# EAGLE design ADS1115-Breakout-5V (EAGLE 8.1.1)
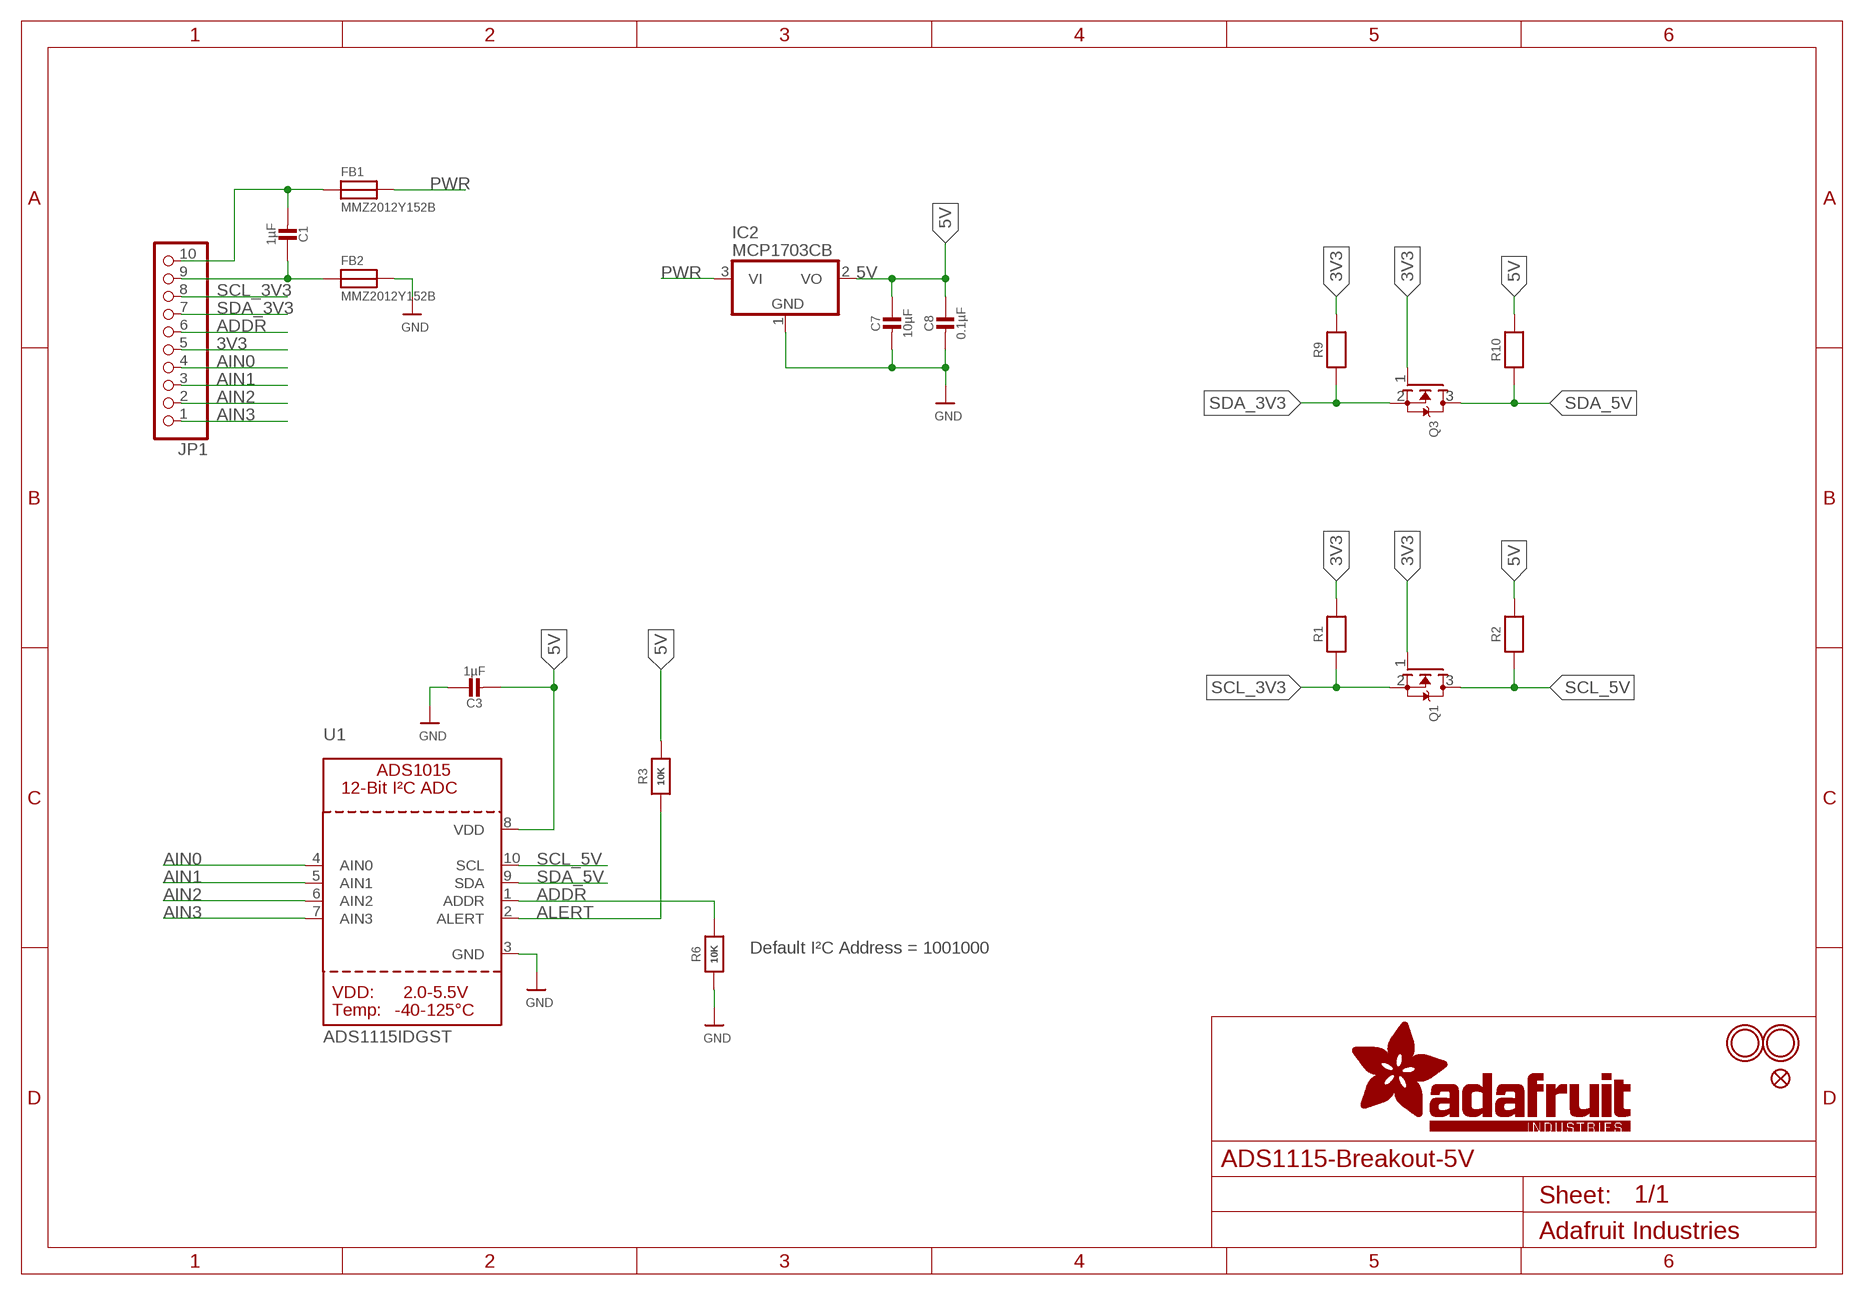
[diagram p0: schematic, sheet 1]

## Parts
C1  1µF  CAP_CERAMIC_0402MP  [_0402MP]
C3  1µF  CAP_CERAMIC_0402MP  [_0402MP]
C7  10µF  CAP_CERAMIC_0402MP  [_0402MP]
C8  0.1µF  CAP_CERAMIC_0402MP  [_0402MP]
FB1  MMZ2012Y152B  FERRITE0805  [0805]
FB2  MMZ2012Y152B  FERRITE0805  [0805]
FID1  FIDUCIAL""  [FIDUCIAL_1MM]
IC2  MCP1703CB  [SOT23]
JP1  HEADER-1X1070MIL  [1X10_ROUND70]
Q1  MOSFET-NREFLOW  [SOT23]
Q3  MOSFET-NREFLOW  [SOT23]
R1  RESISTOR_0402MP  [_0402MP]
R2  RESISTOR_0402MP  [_0402MP]
R3  10K  RESISTOR_0402MP  [_0402MP]
R6  10K  RESISTOR_0402MP  [_0402MP]
R9  RESISTOR_0402MP  [_0402MP]
R10  RESISTOR_0402MP  [_0402MP]
U1  ADS1115IDGST  ADC_ADS1015  [MSOP10]
U$13  MOUNTINGHOLE2.5  [MOUNTINGHOLE_2.5_PLATED]
U$14  MOUNTINGHOLE2.5  [MOUNTINGHOLE_2.5_PLATED]

## Nets
3V3: JP1.5 Q1.1(G) Q3.1(G) R1.2 R9.2
5V: C3.2 C7.1 C8.1 IC2.2(VO) R2.2 R3.2 R10.2 U1.8(VDD)
ADDR: JP1.6 R6.2 U1.1(ADDR)
AIN0: JP1.4 U1.4(AIN0)
AIN1: JP1.3 U1.5(AIN1)
AIN2: JP1.2 U1.6(AIN2)
AIN3: JP1.1 U1.7(AIN3)
ALERT: R3.1 U1.2(ALERT)
GND: C3.1 C7.2 C8.2 FB2.2 IC2.1(GND) R6.1 U1.3(GND)
N$1: C1.2 FB1.1 JP1.10
N$2: C1.1 FB2.1 JP1.9
PWR: FB1.2 IC2.3(VI)
SCL_3V3: JP1.8 Q1.2(S) R1.1
SCL_5V: Q1.3(D) R2.1 U1.10(SCL)
SDA_3V3: JP1.7 Q3.2(S) R9.1
SDA_5V: Q3.3(D) R10.1 U1.9(SDA)

## Notes on the sheet
- Default I²C Address = 1001000

## Library data of the parts
C1 C3 C7 C8 = TSL2591:CAP_CERAMIC: Ceramic Capacitors For new designs, use the packages preceded by an '_' character since they are more reliable: The following footprints should be used on most boards: _0402 - Standard footprint for regular board layouts _0603 - Standard footprint for regular board layouts _0805 - Standard footprint for regular board layouts _1206 - Standard footprint for regular board layouts For extremely tight-pitch boards where space is at a premium, the following 'micro-pitch' footprints can be used (smaller pads, no silkscreen outline, etc.): _0402MP - Micro-pitch footprint for very dense/compact boards _0603MP - Micro-pitch footprint for very dense/compact boards _0805MP - Micro-pitch footprint for very dense/compact boards _1206MP - Micro-pitch footprint for very dense/compact boards
FB1 FB2 = microbuilder:FERRITE: Ferrite Bead 0603 MMZ1608B121C - 120 Ohm, 600mA Ferrite Chip - Digikey: 445-2164-1-ND BK1608HW121-T - 120 Ohm, 600mA Ferrite Chip - Digikey: 587-1876-2-ND 0805 HZ0805B272R-10 - 2.7K Ohm @ 100MHz, 200mA 0.8 Ohm DC Resistance - Digikey: 240-2504-1-ND (see also Murata BLM21BD272SN1L)
FID1 = microbuilder:FIDUCIAL: Fiducial Alignment Points Various fiducial points for machine vision alignment.
IC2 = linear:MCP1703: 250 mA, 16V, Low Quiescent Current LDO Regulator Source: http://ww1.microchip.com/downloads/en/DeviceDoc/22049b.pdf
JP1 = microbuilder:HEADER-1X10: PIN HEADER
Q1 Q3 = adafruit:MOSFET-N: N-Channel Mosfet 2N7002E - 60V 260mA SOT23 [Digikey: 2N7002ET1GOSTR-ND] - REEL BSH103 - 30V 850mA SOT23 [Digikey: 568-5013-1-ND]
R1-R3 R6 R9 R10 = TSL2591:RESISTOR: Resistors For new designs, use the packages preceded by an '_' character since they are more reliable: The following footprints should be used on most boards: _0402 - Standard footprint for regular board layouts _0603 - Standard footprint for regular board layouts _0805 - Standard footprint for regular board layouts _1206 - Standard footprint for regular board layouts For extremely tight-pitch boards where space is at a premium, the following 'micro-pitch' footprints can be used (smaller pads, no silkscreen outline, etc.): _0402MP - Micro-pitch footprint for very dense/compact boards _0603MP - Micro-pitch footprint for very dense/compact boards _0805MP - Micro-pitch footprint for very dense/compact boards _1206MP - Micro-pitch footprint for very dense/compact boards
U1 = microbuilder:ADC_ADS1015: ADS1015 - 12-bit 4-Channel I2C ADC with Internal PGA VDD: 2.0-5.5V Sampling Rate: 3.3ksps Gain Settings: 2/3, 1, 2, 4, 8, 16 I2C Address: ADDR low = 1001000x, ADDR high = 1001001x Internal Comparator The ADS1015 includes an internal comparator that can be set to output a high-level on ALERT when the conversion results exceeeds a pre-defined upper level, and will deassert itself when the level falls below a pre-defined lower threshold level. It can also be set to windowed mode where the ALERT pin will be asserted if the data exceeds the upper threshold or falls below the lower threshold.
U$13 U$14 = microbuilder:MOUNTINGHOLE: Mounting Hole For #2 screws (0.086"/2.18mm width, 0.094"/2.4mm hole) use 2.5mm

## Board
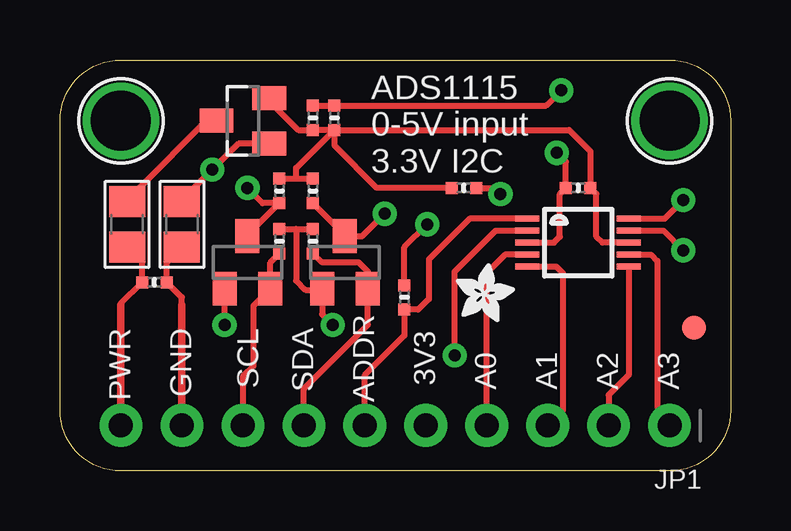
[diagram p1: board, top side]
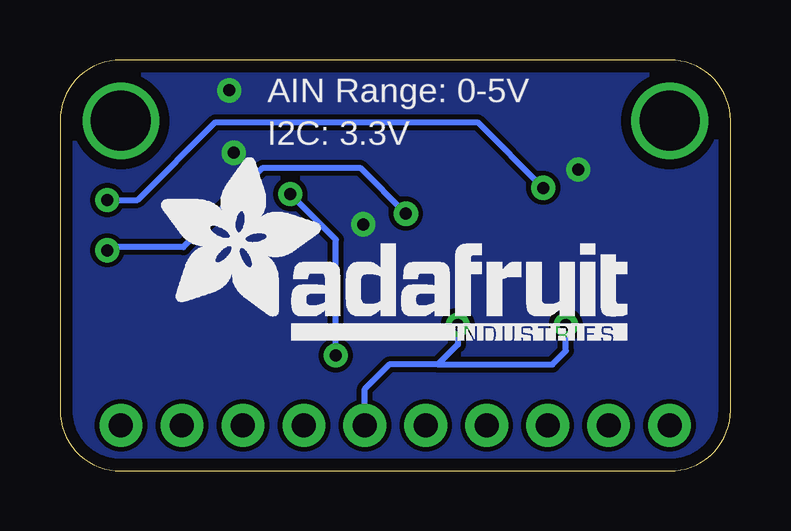
[diagram p2: board, bottom side, seen from below]

Size 27.94 x 17.14 mm. Coordinates in mm from the lower left corner, seen from the top.
Outline: 27.94,14.61 27.94,2.54 arc-90 25.4,0 2.54,0 arc-90 0,2.54 0,14.61 arc-90 2.54,17.14 25.4,17.14 arc-90 27.94,14.61
Copper layers (1*16): Top 0.035mm / dielectric 1.5mm / Bottom 0.035mm
Design rules "default": minimum track width 8mil, minimum drill 0.4mm, track to track 8mil, track to pad 8mil, pad to pad 8mil, via to via 8mil, smd to smd 8mil, copper to edge 20mil, drill to drill 8mil, minimum pad ring 8mil, minimum via ring 10mil, stop-mask expansion 3mil, vias tented up to drill 20mil, thermal gap 8mil

### Footprints (pad centres in the part's own frame; a part is rotated, then mirrored left to right if it is on the bottom)
_0402MP = smd 0.5 x 0.5: 1 -0.508,0; 2 0.508,0
0805 = smd 1.3 x 1.5: 1 -0.95,0; 2 0.95,0
FIDUCIAL_1MM = smd 1 x 1: 1 0,0
SOT23 = smd 1 x 1.4: 1 -0.95,-1.1; 2 0.95,-1.1; 3 0,1.1
1X10_ROUND70 = drill 1 pad 1.778: 1 -11.43,0; 2 -8.89,0; 3 -6.35,0; 4 -3.81,0; 5 -1.27,0; 6 1.27,0; 7 3.81,0; 8 6.35,0; 9 8.89,0; 10 11.43,0
MSOP10 = smd 0.25 x 1: 1 -1,-2.113; 2 -0.5,-2.113; 3 0,-2.113; 4 0.5,-2.113; 5 1,-2.113; 6 1,2.113; 7 0.5,2.113; 8 0,2.113; 9 -0.5,2.113; 10 -1,2.113
MOUNTINGHOLE_2.5_PLATED = drill 2.5 pad 3.2: P$1 0,0

### Placement (x,y rotation side)
C1  3.94,7.87 180 top
C3  21.59,11.81 0 top
C7  10.54,14.73 90 top
C8  11.43,14.73 90 top
FB1  2.79,10.29 90 top
FB2  5.08,10.29 90 top
FID1  26.42,5.97 180 top
IC2  7.62,14.61 90 top
JP1  13.97,1.91 180 top
Q1  7.81,8.7 0 top
Q3  11.87,8.7 0 top
R1  9.14,9.59 90 top
R2  9.14,11.68 90 top
R3  16.83,11.81 180 top
R6  14.35,7.24 270 top
R9  10.54,9.59 90 top
R10  10.54,11.68 90 top
U1  21.59,9.53 270 top
U$13  25.4,14.61 180 top
U$14  2.54,14.61 180 top
U$15  [ADAFRUIT_TEXT_20MM]  23.88,5.46 0 bottom
U$16  [ADAFRUIT_2.5MM]  16.51,6.22 0 top

### Tracks (layer width: path | path; a pad name or v marks a point on that pad's centre or on a via)
3V3  (via drill 0.5)
  Top 0.254: 6.86,7.15 Q1.1 v6.86,6.1 | R1.2 9.84,10.1 | 9.84,10.1 R9.2 | v11.37,6.1 10.93,6.54 Q3.1 10.88,7.56 10.22,7.56 9.84,7.94 9.84,10.1
  Bottom 0.254: JP1.5 15.24,3.43 14.22,4.44 12.19,4.44 | v6.86,6.1 6.86,5.02 7.43,4.44 12.19,4.44 | v11.37,6.1 11.37,5.27 12.19,4.44
5V
  Top 0.254: U1.8 22.61,9.53 22.35,9.78 22.35,11.56 C3.2 22.1,13.34 21.21,14.22 C8.1 | IC2.2 8.72,15.44 9.93,14.22 C7.1 C8.1 | C8.1 11.43,13.59 13.21,11.81 R3.2 | R2.2 9.84,12.19 | 9.84,12.19 R10.2 | 9.84,12.19 9.84,12.64 C8.1
ADDR
  Top 0.254: JP1.6 12.7,4 14.35,5.65 R6.2 14.92,6.73 15.37,7.17 15.37,8.83 17.07,10.53 U1.1
AIN0
  Top 0.254: U1.4 18.55,9.03 17.78,8.26 JP1.4
AIN1
  Top 0.254: U1.5 20.68,8.53 20.95,8.26 20.95,2.54 JP1.3
AIN2
  Top 0.254: U1.6 23.7,4.02 22.86,3.17 JP1.2
AIN3
  Top 0.254: U1.7 24.63,9.03 24.89,8.76 24.89,2.67 JP1.1
ALERT  (via drill 0.5)
  Top 0.254: U1.2 18.15,10.03 16.45,8.32 v16.45,4.83 | R3.1 18.1,11.81 v18.35,11.56
  Bottom 0.254: v16.45,4.83 16.45,9.65 v18.35,11.56
GND  (via drill 0.5)
  Top 0.254: FB2.2 5.08,11.3 v6.35,12.57 7.43,13.66 IC2.1 | U1.3 20.57,9.53 20.83,9.78 20.83,11.56 C3.1 21.08,12.89 v20.7,13.27 | C7.2 C8.2 20.26,15.24 v20.89,15.88 | R6.1 14.35,9.33 v15.3,10.29
  pour Bottom: 27.94,17.14 27.94,0 0,0 0,17.14
N$1
  Top 0.254: 2.54,6.92 2.54,6.98 C1.2 3.43,8.7 FB1.1
  Top 0.305: JP1.10 2.54,6.92 | FB1.1 2.86,9.27
N$2
  Top 0.254: 5.08,6.92 5.08,7.24 C1.1 4.45,8.7 FB2.1
  Top 0.305: JP1.9 5.08,6.92 | FB2.1 4.76,9.02
PWR
  Top 0.254: FB1.2 3.3,11.75 3.3,11.81 6.1,14.61 IC2.3
SCL_3V3
  Top 0.254: JP1.8 7.62,3.94 8.06,4.38 8.06,6.9 Q1.2 8.76,8.7 R1.1
SCL_5V  (via drill 0.5)
  Top 0.254: U1.10 25.19,10.53 v25.97,11.3 | 7.56,9.61 Q1.3 7.81,9.84 R2.1 8.45,11.18 v7.81,11.81
  Bottom 0.254: v25.97,11.3 24.7,11.3 21.46,14.54 10.54,14.54 v7.81,11.81
SDA_3V3
  Top 0.254: JP1.7 10.16,3.43 12.83,6.1 Q3.2 | Q3.2 12.83,7.15 | Q3.2 12.82,8.32 12.45,8.7 10.92,8.7 R9.1
SDA_5V  (via drill 0.5)
  Top 0.254: U1.9 25.15,10.03 v25.97,9.21 | R10.1 11.87,9.84 Q3.3 12.59,9.8 v13.53,10.73
  Bottom 0.254: v25.97,9.21 25.84,9.33 22.8,9.33 19.49,12.65 15.44,12.65 v13.53,10.73

### Text on the board
tPlace: ADS1115 / 0-5V input / 3.3V I2C | PWR | GND | SCL | SDA | ADDR | 3V3 | A0 | A1 | A2 | A3
bPlace: AIN Range: 0-5V | I2C: 3.3V